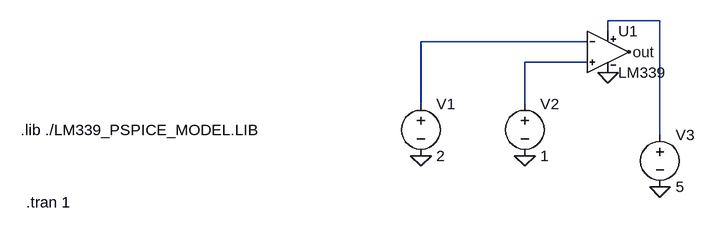
[diagram p0: schematic Draft1.asc]
Draft1.asc, the LTspice schematic file:
Version 4
SHEET 1 920 680
WIRE 864 -32 784 -32
WIRE 784 -16 784 -32
WIRE 752 0 496 0
WIRE 752 32 656 32
WIRE 496 96 496 0
WIRE 656 96 656 32
WIRE 864 144 864 -32
FLAG 496 176 0
FLAG 656 176 0
FLAG 784 48 0
FLAG 816 16 out
FLAG 864 224 0
SYMBOL voltage 496 80 R0
SYMATTR InstName V1
SYMATTR Value 2
SYMBOL voltage 656 80 R0
SYMATTR InstName V2
SYMATTR Value 1
SYMBOL voltage 864 128 R0
WINDOW 123 0 0 Left 0
WINDOW 39 0 0 Left 0
SYMATTR InstName V3
SYMATTR Value 5
SYMBOL LM339 784 16 R0
SYMATTR InstName U1
SYMATTR SpiceModel LM339_PSPICE_MODEL.LIB
TEXT -120 136 Left 2 !.lib ./LM339_PSPICE_MODEL.LIB
TEXT -112 248 Left 2 !.tran 1

The netlist it stands for:
* Draft1.asc
V1 N002 0 2
V2 N003 0 1
V3 N001 0 5
XU1 N003 N002 N001 0 out LM339  ; pins In+ In- V+ V- OUT
.lib ./LM339_PSPICE_MODEL.LIB
.tran 1
.lib LM339_PSPICE_MODEL.LIB
.backanno
.end